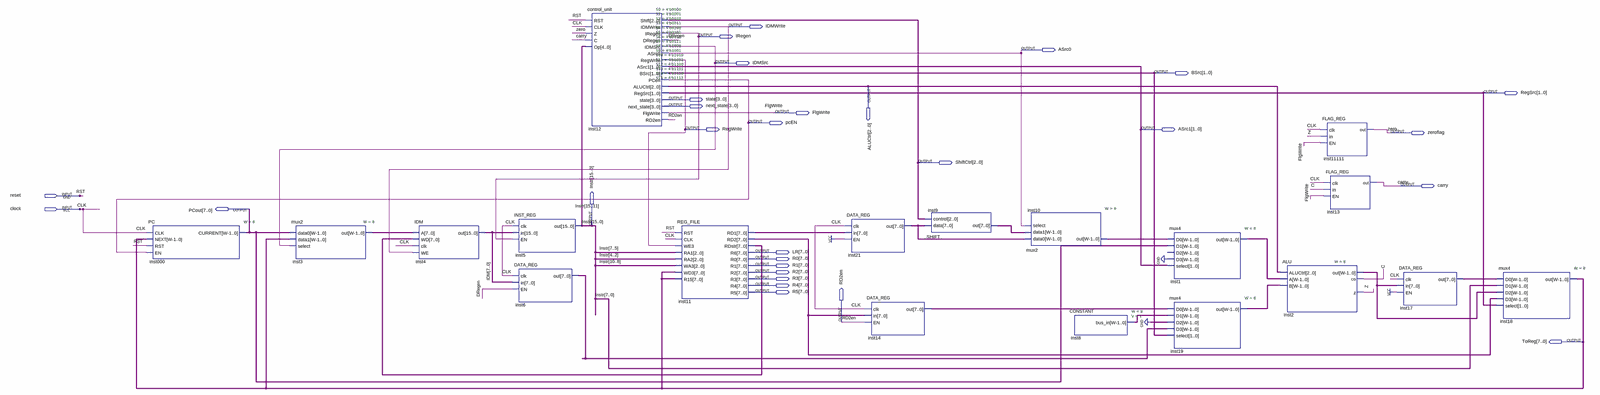
[diagram p0: schematic sheet, whole]
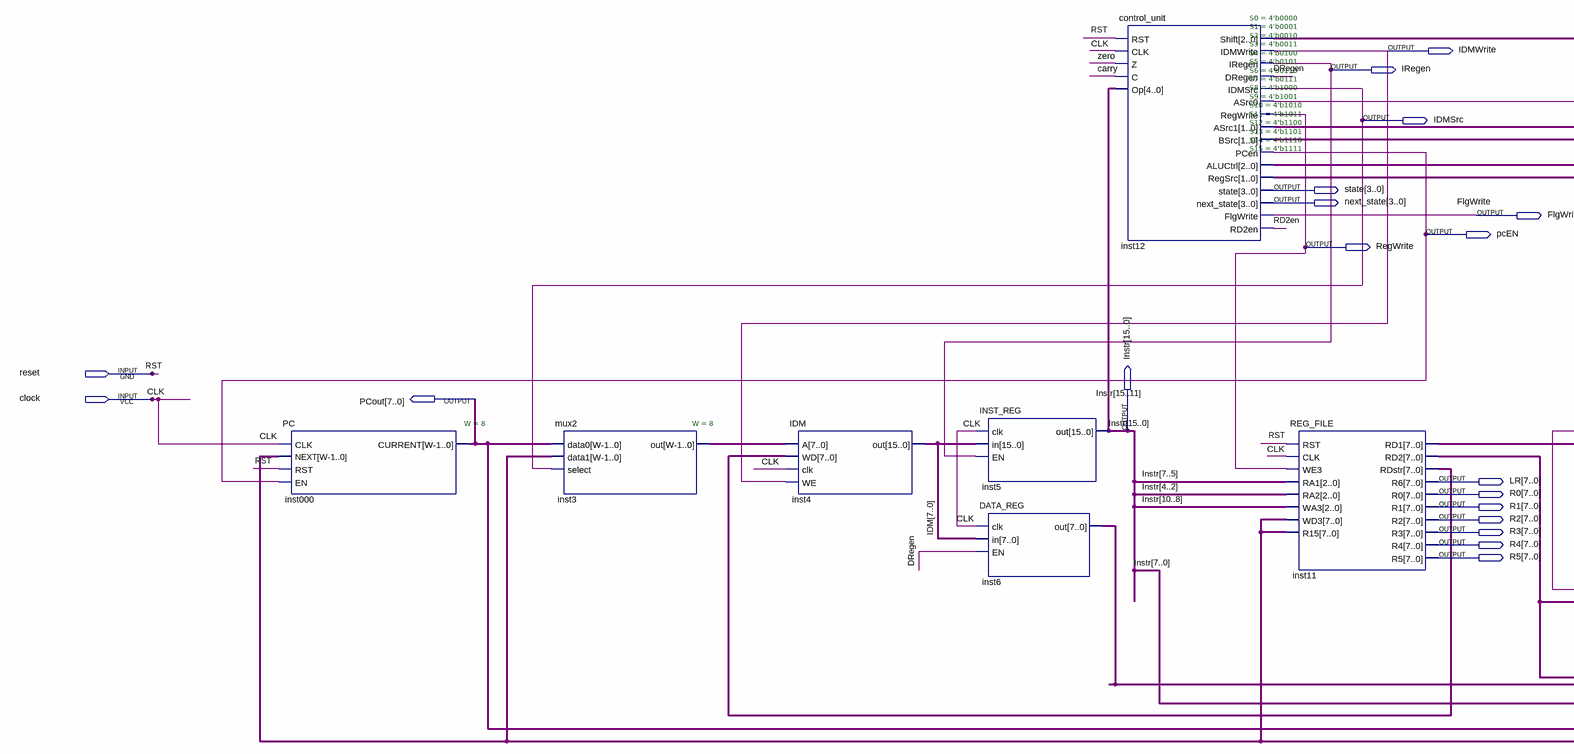
[diagram p1: schematic sheet, left part]
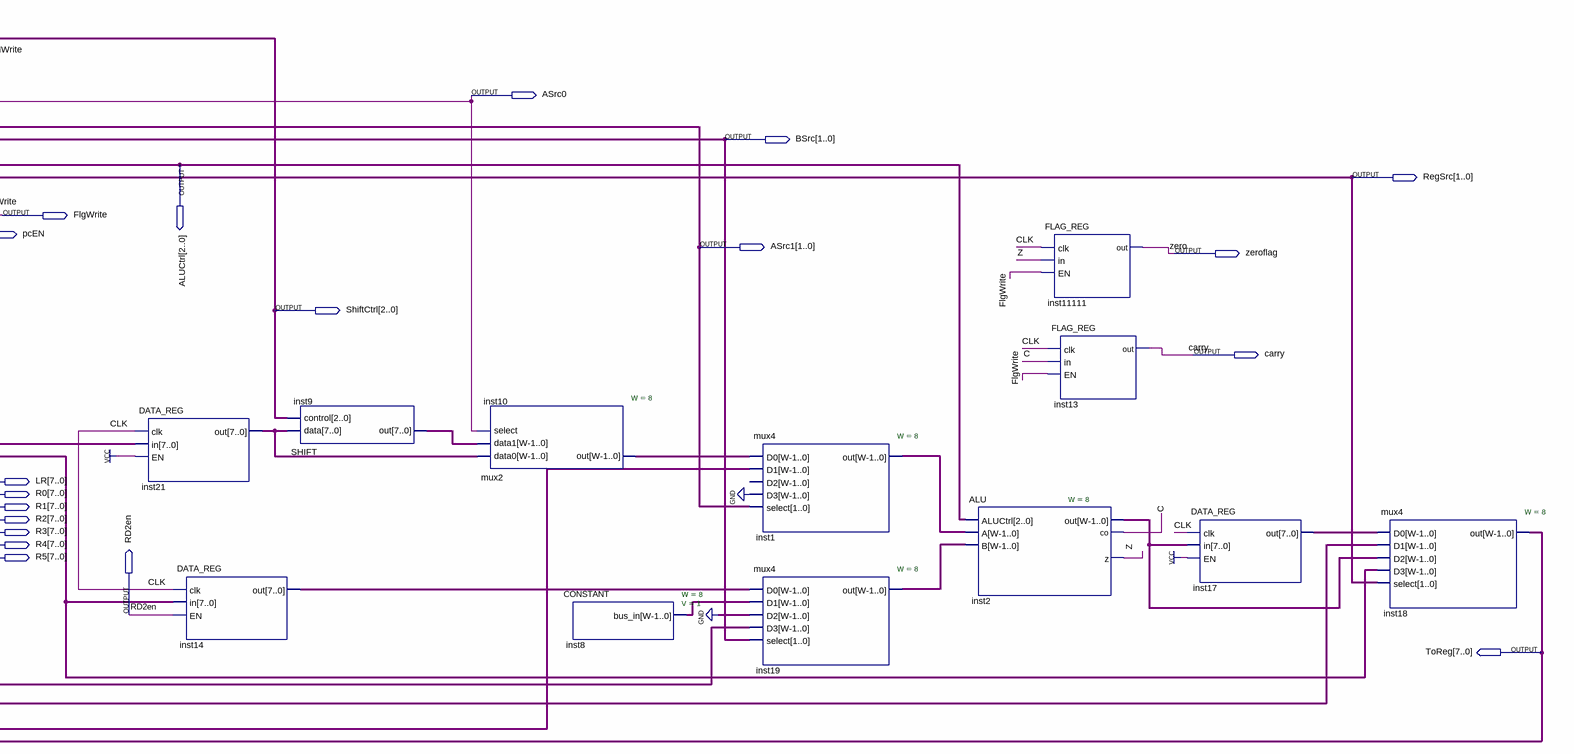
[diagram p2: schematic sheet, right part]
// Quartus schematic multicycle.bdf as structural Verilog: 19 symbols, 29 pins
module multicycle (
  input  reset,
  input  clock,
  output IDMWrite,
  output IRegen,
  output ASrc0,
  output IDMSrc,
  output [1:0] BSrc,
  output [2:0] ALUCtrl,
  output [1:0] RegSrc,
  output [3:0] state,
  output [3:0] next_state,
  output FlgWrite,
  output pcEN,
  output RegWrite,
  output [1:0] ASrc1,
  output zeroflag,
  output [2:0] ShiftCtrl,
  output carry,
  output [7:0] PCout,
  output [15:0] Instr,
  output [7:0] LR,
  output [7:0] R0,
  output [7:0] R1,
  output [7:0] R2,
  output [7:0] R3,
  output [7:0] R4,
  output [7:0] R5,
  output RD2en,
  output [7:0] ToReg
);

  wire C, DRegen, Z;
  wire [7:0] inst1_out, inst2_out, inst3_out, inst6_out, inst8_bus_in, inst9_out, inst10_out, inst11_rd1,
       inst11_rd2, inst11_rdstr, inst14_out, inst17_out, inst19_out, inst21_out;
  wire [15:0] IDM;

  PC #(.W(8)) inst000 (.CLK(clock), .NEXT(ToReg), .RST(reset), .EN(pcEN), .CURRENT(PCout));
  mux2 #(.W(8)) inst3 (.data0(PCout), .data1(ToReg), .select(IDMSrc), .out(inst3_out));
  IDM inst4 (.A(inst3_out), .WD(inst11_rdstr), .clk(clock), .WE(IDMWrite), .out(IDM));
  INST_REG inst5 (.clk(clock), .in(IDM), .EN(IRegen), .out(Instr));
  DATA_REG inst6 (.clk(clock), .in(IDM[7:0]), .EN(DRegen), .out(inst6_out));
  control_unit #(.S0(4'b0000), .S1(4'b0001), .S2(4'b0010), .S3(4'b0011), .S4(4'b0100), .S5(4'b0101), .S6(4'b0110), .S7(4'b0111), .S8(4'b1000), .S9(4'b1001), .S10(4'b1010), .S11(4'b1011), .S12(4'b1100), .S13(4'b1101), .S14(4'b1110), .S15(4'b1111)) inst12 (
    .RST(reset), .CLK(clock), .Z(zeroflag), .C(carry), .Op(Instr[15:11]), .Shift(ShiftCtrl),
    .IDMWrite(IDMWrite), .IRegen(IRegen), .DRegen(DRegen), .IDMSrc(IDMSrc), .ASrc0(ASrc0),
    .RegWrite(RegWrite), .ASrc1(ASrc1), .BSrc(BSrc), .PCen(pcEN), .ALUCtrl(ALUCtrl), .RegSrc(RegSrc),
    .state(state), .next_state(next_state), .FlgWrite(FlgWrite), .RD2en(RD2en));
  REG_FILE inst11 (
    .RST(reset), .CLK(clock), .WE3(RegWrite), .RA1(Instr[7:5]), .RA2(Instr[4:2]), .WA3(Instr[10:8]),
    .WD3(ToReg), .R15(ToReg), .RD1(inst11_rd1), .RD2(inst11_rd2), .RDstr(inst11_rdstr), .R6(LR), .R0(R0),
    .R1(R1), .R2(R2), .R3(R3), .R4(R4), .R5(R5));
  DATA_REG inst21 (.clk(clock), .in(inst11_rd1), .EN(1'b1), .out(inst21_out));
  DATA_REG inst14 (.clk(clock), .in(inst11_rd2), .EN(RD2en), .out(inst14_out));
  SHIFT inst9 (.data(inst21_out), .control(ShiftCtrl), .out(inst9_out));
  mux2 #(.W(8)) inst10 (.data0(inst21_out), .data1(inst9_out), .select(ASrc0), .out(inst10_out));
  CONSTANT #(.W(8), .V(1)) inst8 (.bus_in(inst8_bus_in));
  mux4 #(.W(8)) inst1 (.D0(inst10_out), .D1(PCout), .D3({8{1'b0}}), .select(ASrc1), .out(inst1_out));  // open: D2
  mux4 #(.W(8)) inst19 (
    .D0(inst14_out), .D1(inst8_bus_in), .D2({8{1'b0}}), .D3(inst6_out), .select(BSrc), .out(inst19_out));
  ALU #(.W(8)) inst2 (.ALUCtrl(ALUCtrl), .A(inst1_out), .B(inst19_out), .out(inst2_out), .co(C), .z(Z));
  FLAG_REG inst11111 (.clk(clock), .in(Z), .EN(FlgWrite), .out(zeroflag));
  FLAG_REG inst13 (.clk(clock), .in(C), .EN(FlgWrite), .out(carry));
  DATA_REG inst17 (.clk(clock), .in(inst2_out), .EN(1'b1), .out(inst17_out));
  mux4 #(.W(8)) inst18 (
    .D0(inst17_out), .D1(Instr[7:0]), .D2(inst2_out), .D3(inst11_rd2), .select(RegSrc), .out(ToReg));

  // Other names for the same wires on the sheet: CLK = clock; RST = reset; zero = zeroflag
endmodule
